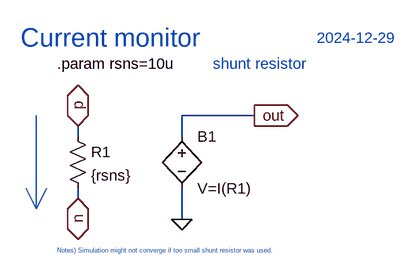
[diagram p0: schematic IMON.asc]
IMON.asc, the LTspice schematic file:
Version 4
SHEET 1 880 680
WIRE 208 -16 96 -16
WIRE -64 16 -64 0
WIRE 96 16 96 -16
WIRE -64 112 -64 96
WIRE 96 144 96 96
FLAG -64 0 p
IOPIN -64 0 BiDir
FLAG -64 112 n
IOPIN -64 112 BiDir
FLAG 208 -16 out
IOPIN 208 -16 Out
FLAG 96 144 0
SYMBOL bv 96 0 R0
SYMATTR InstName B1
SYMATTR Value V=I(R1)
SYMBOL res -80 0 R0
SYMATTR InstName R1
SYMATTR Value {rsns}
TEXT -96 -96 Left 2 !.param rsns=10u
TEXT -152 -136 Left 4 ;Current monitor
TEXT 144 -96 Left 2 ;shunt resistor
TEXT -96 192 Left 0 ;Notes) Simulation might not converge if too small shunt resistor was used.
TEXT 304 -136 Left 2 ;2024-12-29
LINE Normal -128 128 -128 -16
LINE Normal -128 128 -144 96
LINE Normal -128 128 -112 96

The netlist it stands for:
* IMON.asc
B1 out 0 V=I(R1)
R1 p n {rsns}
.param rsns=10u
* Current monitor
* shunt resistor
* Notes) Simulation might not converge if too small shunt resistor was used.
* 2024-12-29
.backanno
.end